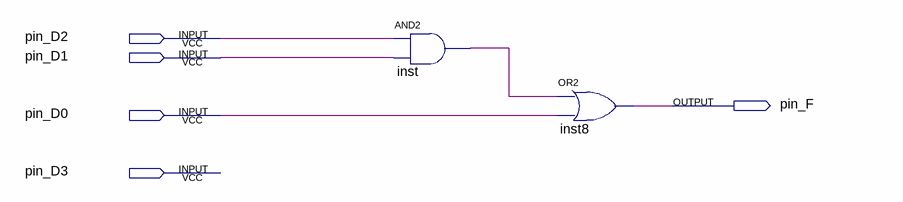
[diagram p0: schematic sheet]
// Quartus schematic Block1.bdf as structural Verilog: 2 symbols, 5 pins
module Block1 (
  input  pin_D2,
  input  pin_D1,
  input  pin_D0,
  input  pin_D3,
  output pin_F
);

  wire inst_out;

  and inst (inst_out, pin_D2, pin_D1);
  or inst8 (pin_F, inst_out, pin_D0);
endmodule
